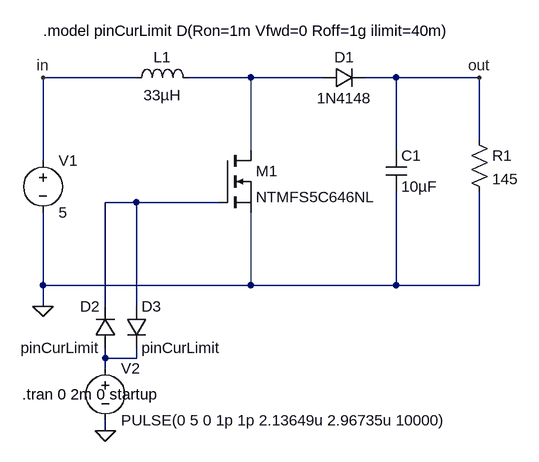
[diagram p0: schematic boostconvNoDriver.asc]
boostconvNoDriver.asc, the LTspice schematic file:
Version 4
SHEET 1 1560 680
WIRE 96 32 -48 32
WIRE 272 32 176 32
WIRE 384 32 272 32
WIRE 496 32 448 32
WIRE 624 32 496 32
WIRE 624 128 624 32
WIRE 272 144 272 32
WIRE 496 144 496 32
WIRE -48 160 -48 32
WIRE 96 224 48 224
WIRE 224 224 96 224
WIRE -48 352 -48 240
WIRE 272 352 272 240
WIRE 272 352 -48 352
WIRE 496 352 496 208
WIRE 496 352 272 352
WIRE 624 352 624 208
WIRE 624 352 496 352
WIRE -48 384 -48 352
WIRE 48 384 48 224
WIRE 96 384 96 224
WIRE 48 464 48 448
WIRE 96 464 96 448
WIRE 96 464 48 464
WIRE 48 480 48 464
WIRE 48 576 48 560
FLAG -48 384 0
FLAG 48 576 0
FLAG 624 32 out
FLAG -48 32 in
SYMBOL voltage -48 144 R0
WINDOW 123 0 0 Left 0
WINDOW 39 24 124 Left 2
SYMATTR InstName V1
SYMATTR Value 5
SYMBOL nmos 224 144 R0
SYMATTR InstName M1
SYMATTR Value NTMFS5C646NL
SYMBOL voltage 48 464 R0
WINDOW 123 0 0 Left 0
WINDOW 39 0 0 Left 0
SYMATTR InstName V2
SYMATTR Value PULSE(0 5 0 1p 1p 2.13649u 2.96735u 10000)
SYMBOL ind 80 48 R270
WINDOW 0 32 56 VTop 2
WINDOW 3 5 56 VBottom 2
SYMATTR InstName L1
SYMATTR Value 33µH
SYMBOL diode 384 48 R270
WINDOW 0 32 32 VTop 2
WINDOW 3 0 32 VBottom 2
SYMATTR InstName D1
SYMATTR Value 1N4148
SYMBOL cap 480 144 R0
SYMATTR InstName C1
SYMATTR Value 10µF
SYMBOL res 608 112 R0
SYMATTR InstName R1
SYMATTR Value 145
SYMBOL diode 64 448 R180
WINDOW 0 24 64 Left 2
WINDOW 3 24 0 Left 2
SYMATTR InstName D2
SYMATTR Value pinCurLimit
SYMBOL diode 80 384 R0
SYMATTR InstName D3
SYMATTR Value pinCurLimit
TEXT -80 520 Left 2 !.tran 0 2m 0 startup
TEXT -48 -40 Left 2 !.model pinCurLimit D(Ron=1m Vfwd=0 Roff=1g ilimit=40m)

The netlist it stands for:
* boostconvNoDriver.asc
V1 in 0 5
M1 N001 N002 0 0 NTMFS5C646NL
V2 N003 0 PULSE(0 5 0 1p 1p 2.13649u 2.96735u 10000)
L1 in N001 33µH
D1 N001 out 1N4148
C1 out 0 10µF
R1 out 0 145
D2 N003 N002 pinCurLimit
D3 N002 N003 pinCurLimit
.model D D
.lib standard.dio
.model NMOS NMOS
.model PMOS PMOS
.lib standard.mos
.tran 0 2m 0 startup
.model pinCurLimit D(Ron=1m Vfwd=0 Roff=1g ilimit=40m)
.backanno
.end